# EAGLE design flasher (EAGLE 7.6.0)
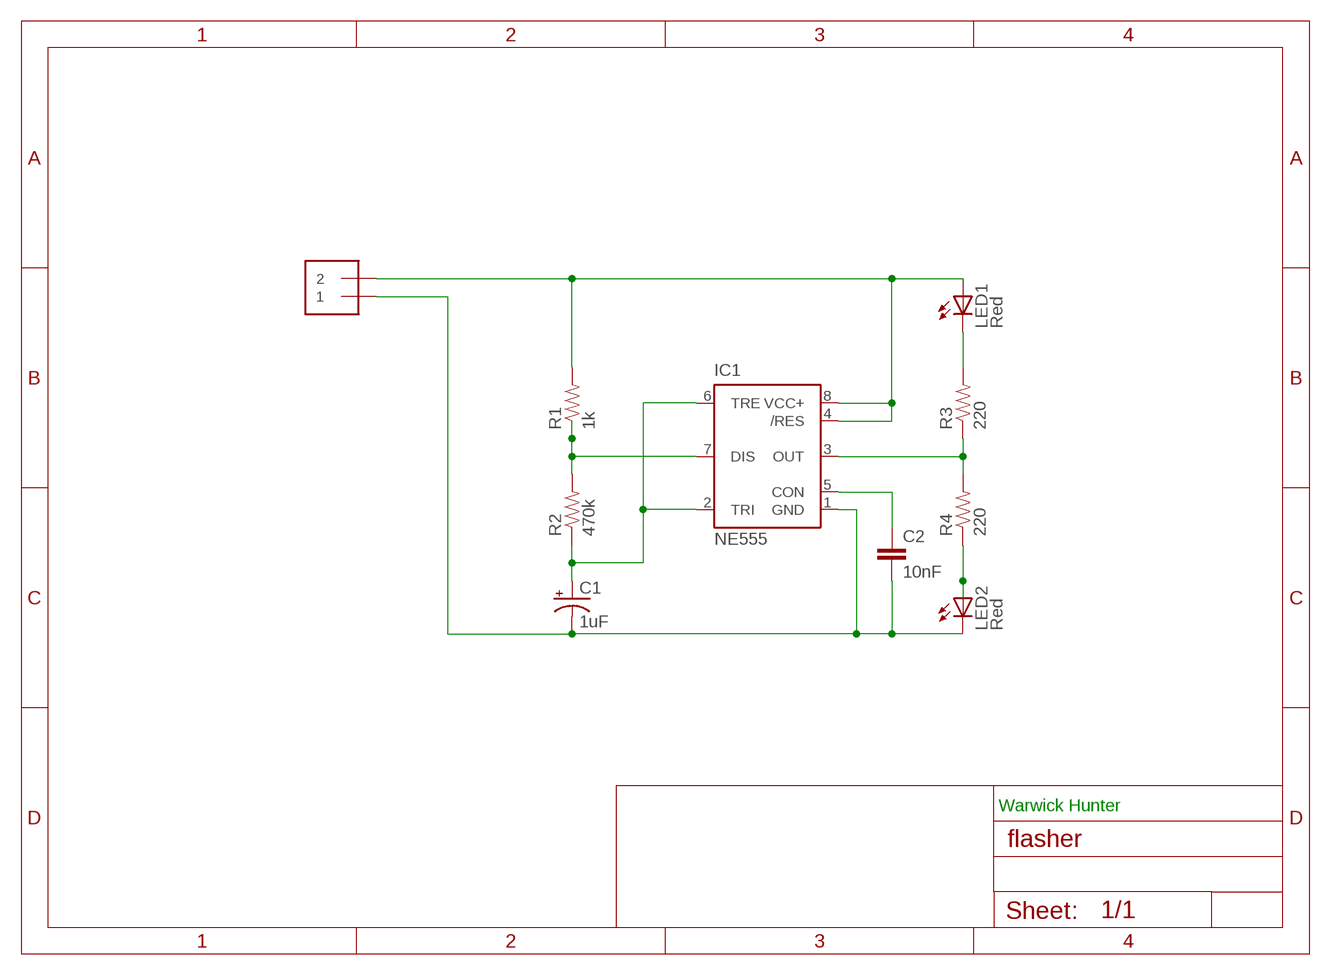
[diagram p0: schematic, sheet 1]

## Parts
C1  1uF  CAP_POLPTH2  [CPOL-RADIAL-10UF-25V]
C2  10nF  CAPPTH  [CAP-PTH-SMALL]
IC1  NE555  [DIL-08]
J1  1X2-3.5MM  [1X2-3.5MM]
LED1  Red  LED5MM  [LED5MM]
LED2  Red  LED5MM  [LED5MM]
R1  1k  RESISTORAXIAL-0.3  [AXIAL-0.3]
R2  470k  RESISTORAXIAL-0.3  [AXIAL-0.3]
R3  220  RESISTORAXIAL-0.3  [AXIAL-0.3]
R4  220  RESISTORAXIAL-0.3  [AXIAL-0.3]

## Nets
GND: C1.2(-) C2.2 IC1.1(GND) J1.1 LED2.K(C)
N$2: LED1.K(C) R3.P$2
N$3: IC1.3(OUT) R3.P$1 R4.P$2
N$4: LED2.A R4.P$1
N$6: C1.1(+) IC1.2(TRI) IC1.6(TRE) R2.P$1
N$7: IC1.7(DIS) R1.P$1 R2.P$2
N$9: C2.1 IC1.5(CON)
VCC+: IC1.4(/RES) IC1.8(VCC+) J1.2 LED1.A R1.P$2

## Notes on the sheet
- Warwick Hunter

## Library data of the parts
C1 = SparkFun-Capacitors:CAP_POL: Capacitor Polarized These are standard SMD and PTH capacitors. Normally 10uF, 47uF, and 100uF in electrolytic and tantalum varieties. Always verify the external diameter of the through hole cap, it varies with capacity, voltage, and manufacturer. The EIA devices should be standard.
C2 = SparkFun-Capacitors:CAP: Capacitor Standard 0603 ceramic capacitor, and 0.1" leaded capacitor.
IC1 = st-microelectronics:NE555: General purpose bipolar Timer; MF: Arrow Electronics; MPN: NE555N; OC_FARNELL: 1467742; OC_NEWARK: 89K1486
J1 = adafruit:1X2: 3.5mm Terminal block http://www.ladyada.net/library/pcb/eaglelibrary.html
LED1 LED2 = adafruit:LED: LED OSRAM: - CHIPLED LG R971, LG N971, LY N971, LG Q971, LY Q971, LO R971, LY R971 LH N974, LH R974 LS Q976, LO Q976, LY Q976 LO Q996 - Hyper CHIPLED LW Q18S LB Q993, LB Q99A, LB R99A - SideLED LS A670, LO A670, LY A670, LG A670, LP A670 LB A673, LV A673, LT A673, LW A673 LH A674 LY A675 LS A676, LA A676, LO A676, LY A676, LW A676 LS A679, LY A679, LG A679 - Hyper Micro SIDELED® LS Y876, LA Y876, LO Y876, LY Y876 LT Y87S - SmartLED LW L88C, LW L88S LB L89C, LB L89S, LG L890 LS L89K, LO L89K, LY L89K LS L896, LA L896, LO L896, LY L896 - TOPLED LS T670, LO T670, LY T670, LG T670, LP T670 LSG T670, LSP T670, LSY T670, LOP T670, LYG T670 LG T671, LOG T671, LSG T671 LB T673, LV T673, LT T673, LW T673 LH T674 LS T676, LA T676, LO T676, LY T676, LB T676, LH T676, LSB T676, LW T676 LB T67C, LV T67C, LT T67C, LS T67K, LO T67K, LY T67K, LW E67C LS E67B, LA E67B, LO E67B, LY E67B, LB E67C, LV E67C, LT E67C LW T67C LS T679, LY T679, LG T679 LS T770, LO T770, LY T770, LG T770, LP T770 LB T773, LV T773, LT T773, LW T773 LH T774 LS E675, LA E675, LY E675, LS T675 LS T776, LA T776, LO T776, LY T776, LB T776 LHGB T686 LT T68C, LB T68C - Hyper Mini TOPLED® LB M676 - Mini TOPLED Santana® LG M470 LS M47K, LO M47K, LY M47K Source: http://www.osram.convergy.de/
R1-R4 = SparkFun-Resistors:RESISTOR: Resistor Basic schematic elements and footprints for 0603, 1206, and PTH resistors.

## Board
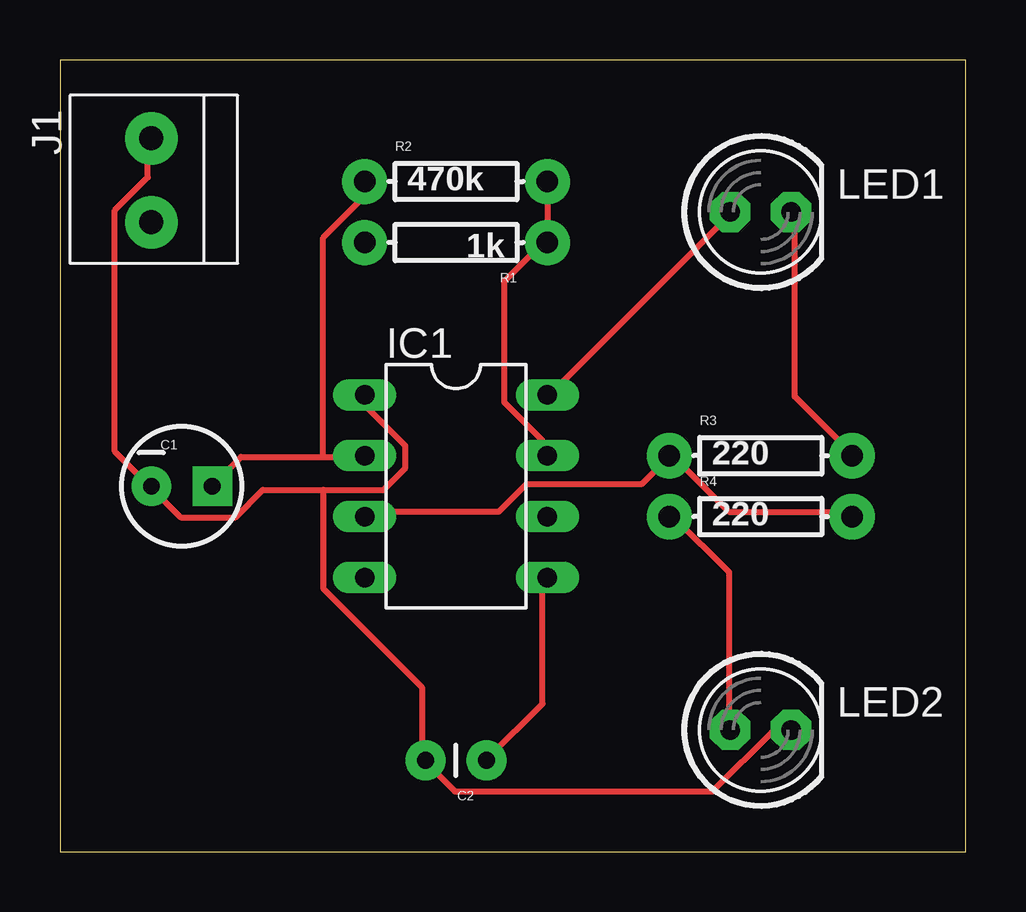
[diagram p1: board, top side]
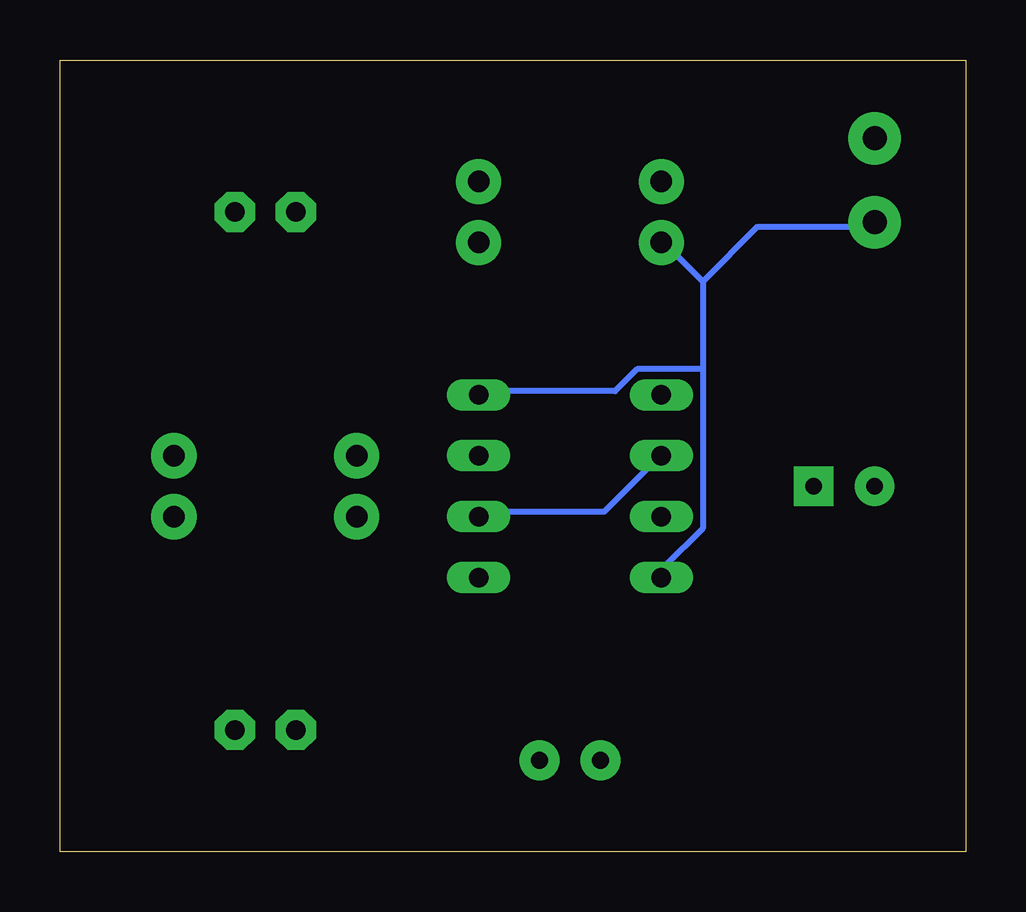
[diagram p2: board, bottom side, seen from below]

Size 37.77 x 33.01 mm. Coordinates in mm from the lower left corner, seen from the top.
Outline: 0,0 37.77,0 37.77,33.01 0,33.01 0,0
Copper layers (1*16): Top 0.035mm / dielectric 1.5mm / Bottom 0.035mm
Design rules "default": minimum track width 10mil, minimum drill 24mil, track to track 8mil, track to pad 8mil, pad to pad 8mil, via to via 8mil, smd to smd 8mil, copper to edge 40mil, drill to drill 8mil, minimum pad ring 10mil, minimum via ring 8mil, stop-mask expansion 4mil, vias tented up to drill 0mil, thermal gap 10mil

### Footprints (pad centres in the part's own frame; a part is rotated, then mirrored left to right if it is on the bottom)
CPOL-RADIAL-10UF-25V = drill 0.7 pad 1.651 square: 1 1.27,0 | drill 0.7 pad 1.651: 2 -1.27,0
CAP-PTH-SMALL = drill 0.7 pad 1.651: 1 0,0; 2 2.54,0
DIL-08 = drill 0.813 long: 1 -3.81,-3.81; 2 -1.27,-3.81; 3 1.27,-3.81; 4 3.81,-3.81; 5 3.81,3.81; 6 1.27,3.81; 7 -1.27,3.81; 8 -3.81,3.81
1X2-3.5MM = drill 1 pad 2.184: 1 1.8,0; 2 -1.7,0
LED5MM = drill 0.813 pad 1.676 octagon: A -1.27,0; K 1.27,0
AXIAL-0.3 = drill 0.9 pad 1.88: P$1 -3.81,0; P$2 3.81,0

### Placement (x,y rotation side)
C1  5.08,15.24 0 top
C2  17.78,3.81 180 top
IC1  16.51,15.24 270 top
J1  3.81,27.94 90 top
LED1  29.21,26.67 0 top
LED2  29.21,5.08 0 top
R1  16.51,25.4 180 top
R2  16.51,27.94 0 top
R3  29.21,16.51 0 top
R4  29.21,13.97 0 top

### Tracks (layer width: path | path; a pad name or v marks a point on that pad's centre or on a via)
GND
  Top 0.254: 10.97,15.09 8.46,15.09 7.32,13.95 5.03,13.95 3.89,15.09 C1.2 3.66,15.32 2.29,16.69 2.29,26.75 3.66,28.12 3.66,29.72 J1.1 | 10.97,15.09 13.49,15.09 14.4,16 14.4,16.92 12.8,18.52 12.8,18.97 IC1.1 | 10.97,15.09 10.97,10.97 15.09,6.86 15.09,3.89 C2.2 15.32,3.66 16.46,2.52 27.2,2.52 29.72,5.03 30.4,5.03 LED2.K
N$2
  Top 0.254: LED1.K 30.63,26.52 30.63,18.97 32.92,16.69 R3.P$2
N$3
  Top 0.254: IC1.3 12.8,14.17 18.29,14.17 19.43,15.32 24.23,15.32 25.38,16.46 R3.P$1 25.6,16.46 27.89,14.17 32.92,14.17 R4.P$2
N$4
  Top 0.254: LED2.A 27.89,5.26 27.89,11.66 25.6,13.95 R4.P$1
N$6
  Top 0.254: 10.97,16.46 7.54,16.46 6.4,15.32 C1.1 | 10.97,16.46 12.57,16.46 IC1.2 | 10.97,16.46 10.97,25.6 12.57,27.2 12.57,27.89 R2.P$1
  Bottom 0.254: IC1.6 20.12,14.17 15.09,14.17 12.8,16.46 IC1.2
N$7
  Top 0.254: IC1.7 20.12,16.69 20.12,17.14 18.52,18.75 18.52,23.77 20.12,25.38 R1.P$1 20.34,25.6 20.34,27.89 R2.P$2
N$9
  Top 0.254: IC1.5 20.12,11.43 20.12,6.17 17.83,3.89 C2.1
VCC+
  Top 0.254: LED1.A 27.89,26.52 20.34,18.97 IC1.8
  Bottom 0.254: 10.97,23.77 10.97,20.12 | 10.97,20.12 10.97,13.49 12.57,11.89 12.57,11.43 IC1.4 | 10.97,23.77 12.57,25.38 R1.P$2 | 10.97,20.12 13.72,20.12 14.63,19.2 20.12,19.2 IC1.8 | 10.97,23.77 8.69,26.06 3.89,26.06 J1.2